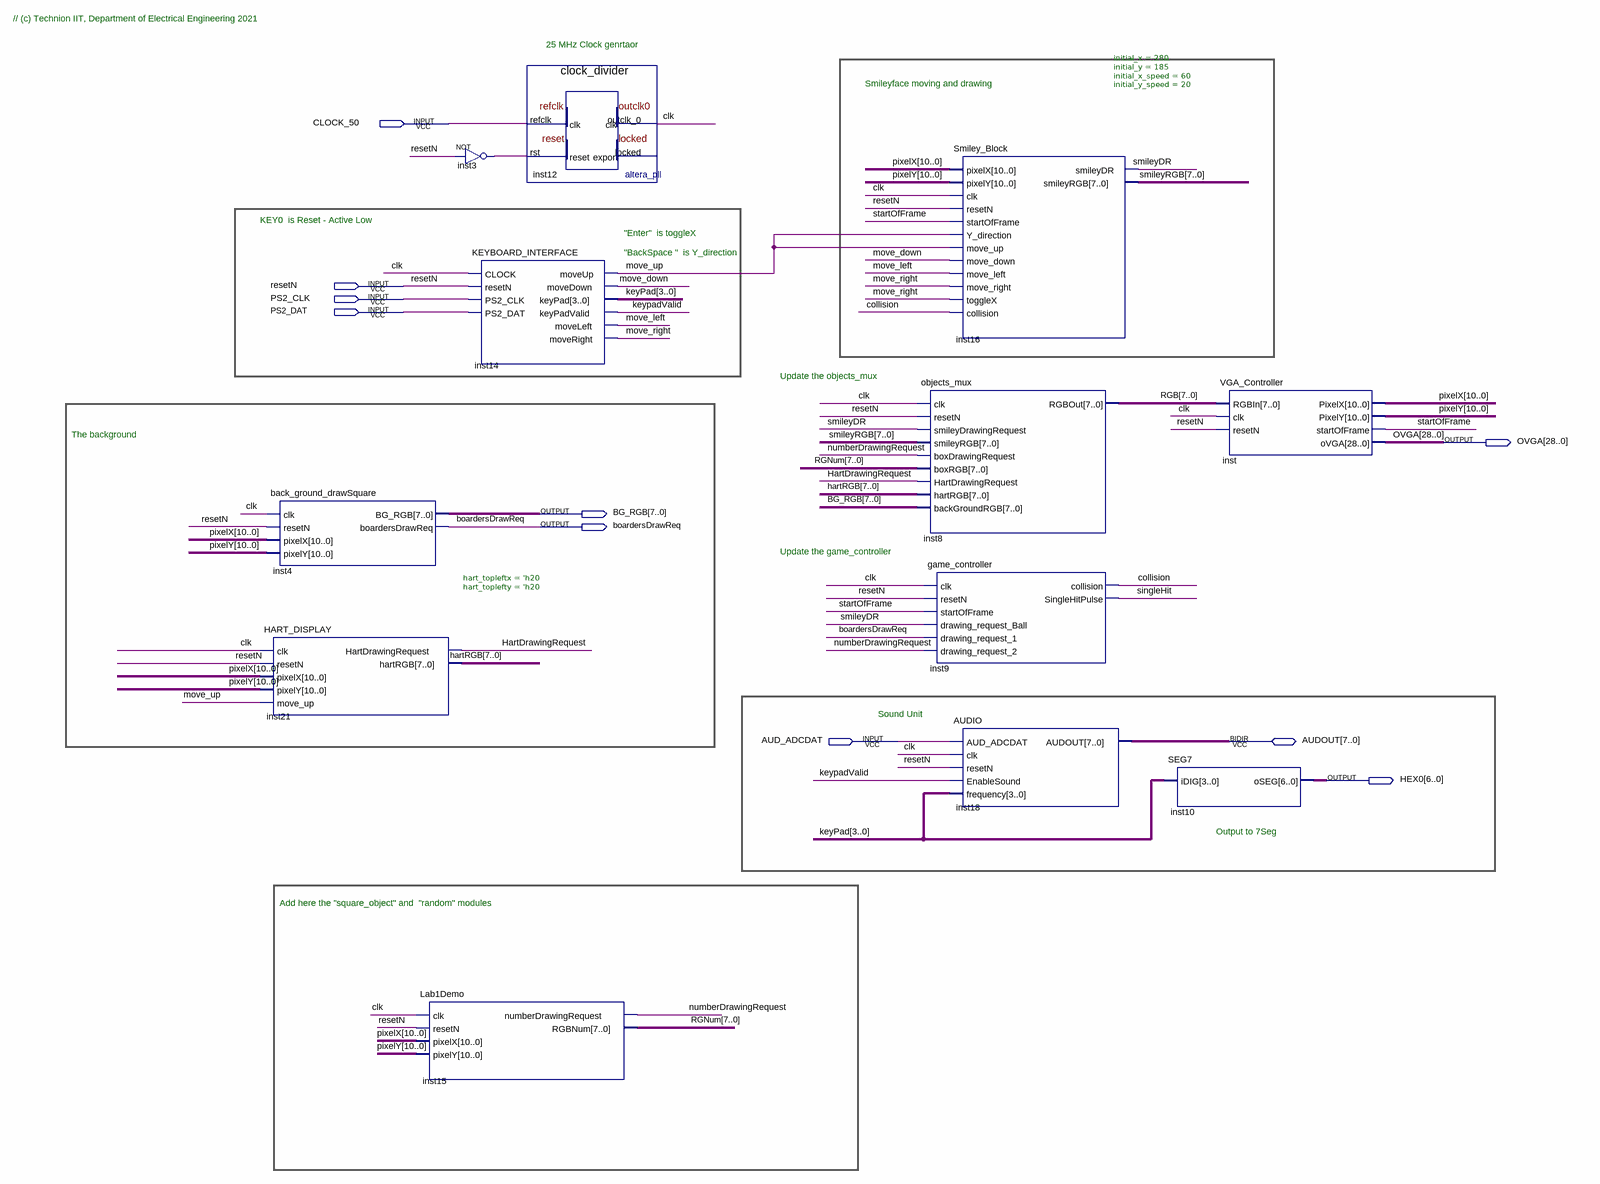
[diagram p0: schematic sheet]
// Quartus schematic TOP_VGA_DEMO_KBD.bdf as structural Verilog: 12 symbols, 10 pins
module TOP_VGA_DEMO_KBD (
  input  CLOCK_50,
  input  resetN,
  input  PS2_CLK,
  input  PS2_DAT,
  input  AUD_ADCDAT,
  inout  [7:0] AUDOUT,
  output [28:0] OVGA,
  output [7:0] BG_RGB,
  output boardersDrawReq,
  output [6:0] HEX0
);

  wire clk, collision, HartDrawingRequest, inst3_out, keypadValid, move_down, move_left, move_right, move_up,
       numberDrawingRequest, singleHit, smileyDR, startOfFrame;
  wire [3:0] keyPad;
  wire [7:0] hartRGB, RGB, RGNum, smileyRGB;
  wire [10:0] pixelX, pixelY;

  HART_DISPLAY #(.hart_topleftx('h20), .hart_toplefty('h20)) inst21 (
    .clk(clk), .resetN(resetN), .pixelX(pixelX), .pixelY(pixelY), .move_up(move_up),
    .HartDrawingRequest(HartDrawingRequest), .hartRGB(hartRGB));
  back_ground_drawSquare inst4 (
    .clk(clk), .resetN(resetN), .pixelX(pixelX), .pixelY(pixelY), .BG_RGB(BG_RGB),
    .boardersDrawReq(boardersDrawReq));
  Lab1Demo inst15 (
    .clk(clk), .resetN(resetN), .pixelX(pixelX), .pixelY(pixelY),
    .numberDrawingRequest(numberDrawingRequest), .RGBNum(RGNum));
  not inst3 (inst3_out, resetN);
  KEYBOARD_INTERFACE inst14 (
    .CLOCK(clk), .resetN(resetN), .PS2_CLK(PS2_CLK), .PS2_DAT(PS2_DAT), .moveUp(move_up),
    .moveDown(move_down), .keyPad(keyPad), .keyPadValid(keypadValid), .moveLeft(move_left),
    .moveRight(move_right));
  clock_divider inst12 (.refclk(CLOCK_50), .rst(inst3_out), .outclk_0(clk));  // open: locked
  objects_mux inst8 (
    .clk(clk), .resetN(resetN), .smileyDrawingRequest(smileyDR), .smileyRGB(smileyRGB),
    .boxDrawingRequest(numberDrawingRequest), .boxRGB(RGNum), .HartDrawingRequest(HartDrawingRequest),
    .hartRGB(hartRGB), .backGroundRGB(BG_RGB), .RGBOut(RGB));
  game_controller inst9 (
    .clk(clk), .resetN(resetN), .startOfFrame(startOfFrame), .drawing_request_Ball(smileyDR),
    .drawing_request_1(boardersDrawReq), .drawing_request_2(numberDrawingRequest), .collision(collision),
    .SingleHitPulse(singleHit));
  Smiley_Block #(.initial_x(280), .initial_y(185), .initial_x_speed(60), .initial_y_speed(20)) inst16 (
    .pixelX(pixelX), .pixelY(pixelY), .clk(clk), .resetN(resetN), .startOfFrame(startOfFrame),
    .Y_direction(move_up), .move_up(move_up), .move_down(move_down), .move_left(move_left),
    .move_right(move_right), .toggleX(move_right), .collision(collision), .smileyDR(smileyDR),
    .smileyRGB(smileyRGB));
  AUDIO inst18 (
    .AUD_ADCDAT(AUD_ADCDAT), .clk(clk), .resetN(resetN), .EnableSound(keypadValid), .frequency(keyPad),
    .AUDOUT(AUDOUT));
  SEG7 inst10 (.iDIG(keyPad), .oSEG(HEX0));
  VGA_Controller inst (
    .RGBIn(RGB), .clk(clk), .resetN(resetN), .PixelX(pixelX), .PixelY(pixelY), .startOfFrame(startOfFrame),
    .oVGA(OVGA));

  // Notes on the sheet:
  //   // (c) Technion IIT, Department of Electrical Engineering 2021
  //   25 MHz Clock genrtaor
  //   Smileyface moving and drawing
  //   KEY0  is Reset - Active Low
  //   "Enter"  is toggleX
  //   "BackSpace "  is Y_direction
  //   Update the objects_mux
  //   The background
  //   Update the game_controller
  //   Sound Unit
  //   Output to 7Seg
  //   Add here the "square_object" and  "random" modules
endmodule
